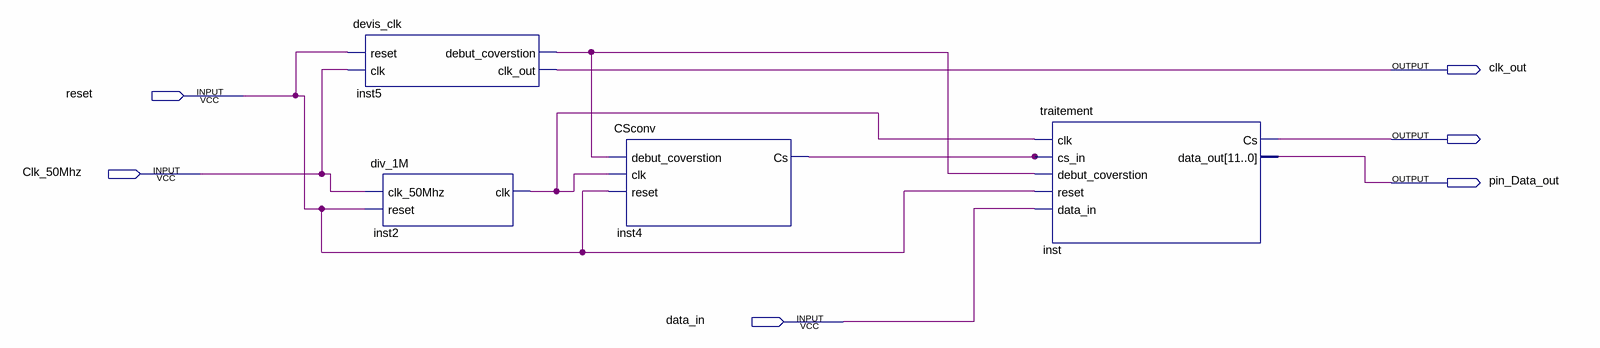
[diagram p0: schematic sheet]
// Quartus schematic spi_rayane.bdf as structural Verilog: 4 symbols, 6 pins
module spi_rayane (
  input  reset,
  input  Clk_50Mhz,
  input  data_in,
  output clk_out,
  output pin_Data_out
);

  wire inst2_clk, inst4_cs, inst5_debut_coverstion, inst_cs;

  devis_clk inst5 (.reset(reset), .clk(Clk_50Mhz), .debut_coverstion(inst5_debut_coverstion), .clk_out(clk_out));
  div_1M inst2 (.clk_50Mhz(Clk_50Mhz), .reset(reset), .clk(inst2_clk));
  CSconv inst4 (.debut_coverstion(inst5_debut_coverstion), .clk(inst2_clk), .reset(reset), .Cs(inst4_cs));
  traitement inst (
    .clk(inst2_clk), .cs_in(inst4_cs), .debut_coverstion(inst5_debut_coverstion), .reset(reset),
    .data_in(data_in), .Cs(inst_cs), .data_out(pin_Data_out));
endmodule
